# EAGLE design bat (EAGLE 9.5.1)
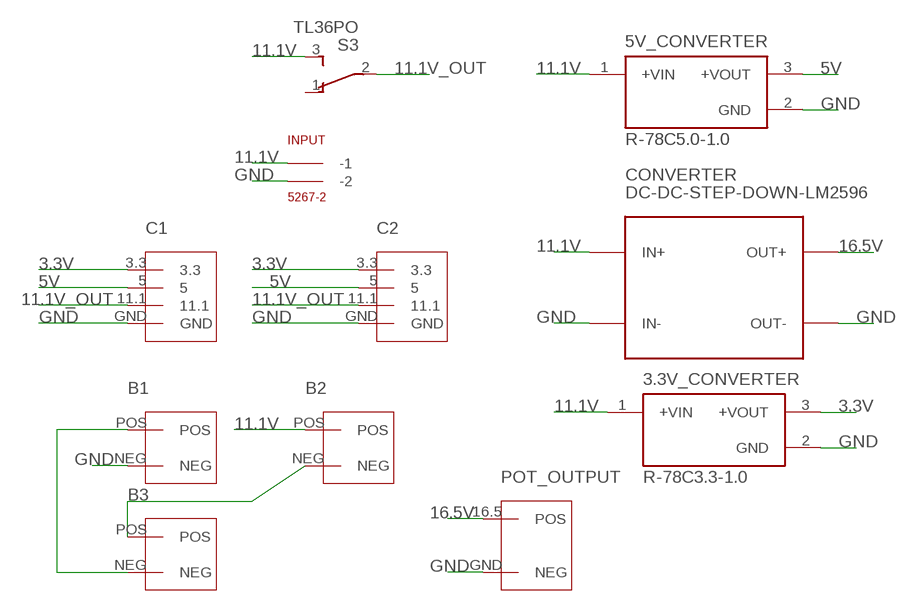
[diagram p0: schematic, sheet 1]

## Parts
3.3V_CONVERTER  R-78C3.3-1.0  R-78C5.0-1.0  [CONV_R-78C5.0-1.0]
5V_CONVERTER  R-78C5.0-1.0  [CONV_R-78C5.0-1.0]
B1  2_PIN_WIRE  [2_PIN_WIRE]
B2  2_PIN_WIRE  [2_PIN_WIRE]
B3  2_PIN_WIRE  [2_PIN_WIRE]
C1  4_PIN_WIRE  [4_PIN_WIRE]
C2  4_PIN_WIRE  [4_PIN_WIRE]
CONVERTER  DC-DC-STEP-DOWN-LM2596  [DC-DC-STEP-DOWN-LM2596]
INPUT  5267-2  [5267-2]
POT_OUTPUT  2_PIN_SMALL  [2_PIN_SMALL]
S3  TL36PO  [TL3XPO]

## Nets
3.3V: 3.3V_CONVERTER.3(+VOUT) C1.3.3 C2.3.3
5V: 5V_CONVERTER.3(+VOUT) C1.5 C2.5
11.1V: 3.3V_CONVERTER.1(+VIN) 5V_CONVERTER.1(+VIN) B2.POS CONVERTER.IN+ INPUT.P$1(-1) S3.3(S)
11.1V_OUT: C1.11.1 C2.11.1 S3.2(P)
16.5V: CONVERTER.OUT+ POT_OUTPUT.16.5(POS)
GND: 3.3V_CONVERTER.2(GND) 5V_CONVERTER.2(GND) B1.NEG C1.GND C2.GND CONVERTER.IN- CONVERTER.OUT- INPUT.P$2(-2) POT_OUTPUT.GND(NEG)
N$1: B1.POS B3.NEG
N$2: B2.NEG B3.POS
Unconnected: S3.1(O)

## Library data of the parts
3.3V_CONVERTER 5V_CONVERTER = R-78C5.0-1.0:R-78C5.0-1.0: 1.0 Amp SIP3 Single Output; AVAILABILITY: Unavailable; DESCRIPTION: 1A DC/DC-Converter 'INNOLINE' SIP3 reg; MF: Recom Power; MP: R-78C5.0-1.0; PACKAGE: SIP-3 Recom Power; PRICE: None
B1-B3 = R-78C5.0-1.0:2_PIN_WIRE
C1 C2 = R-78C5.0-1.0:4_PIN_WIRE
CONVERTER = diy-modules:DC-DC-STEP-DOWN-LM2596: DC/DC Step-Down Regulator based on LM2596-ADJ chip LM2596 datasheet available here: http://www.ti.com/lit/ds/symlink/lm2596.pdf Click here to find device on ebay.com <http://www.ebay.com/sch/lm2596+power+regulator>
INPUT = con-molex-spox:5267-2
POT_OUTPUT = R-78C5.0-1.0:2_PIN_SMALL
S3 = switch:TL36PO: TINY SWITCH ON - ON Source: http://www2.produktinfo.conrad.com/datenblaetter/700000-724999/705152-da-01-de-Subminiaturschalter_TL_36YO.pdf

## Board
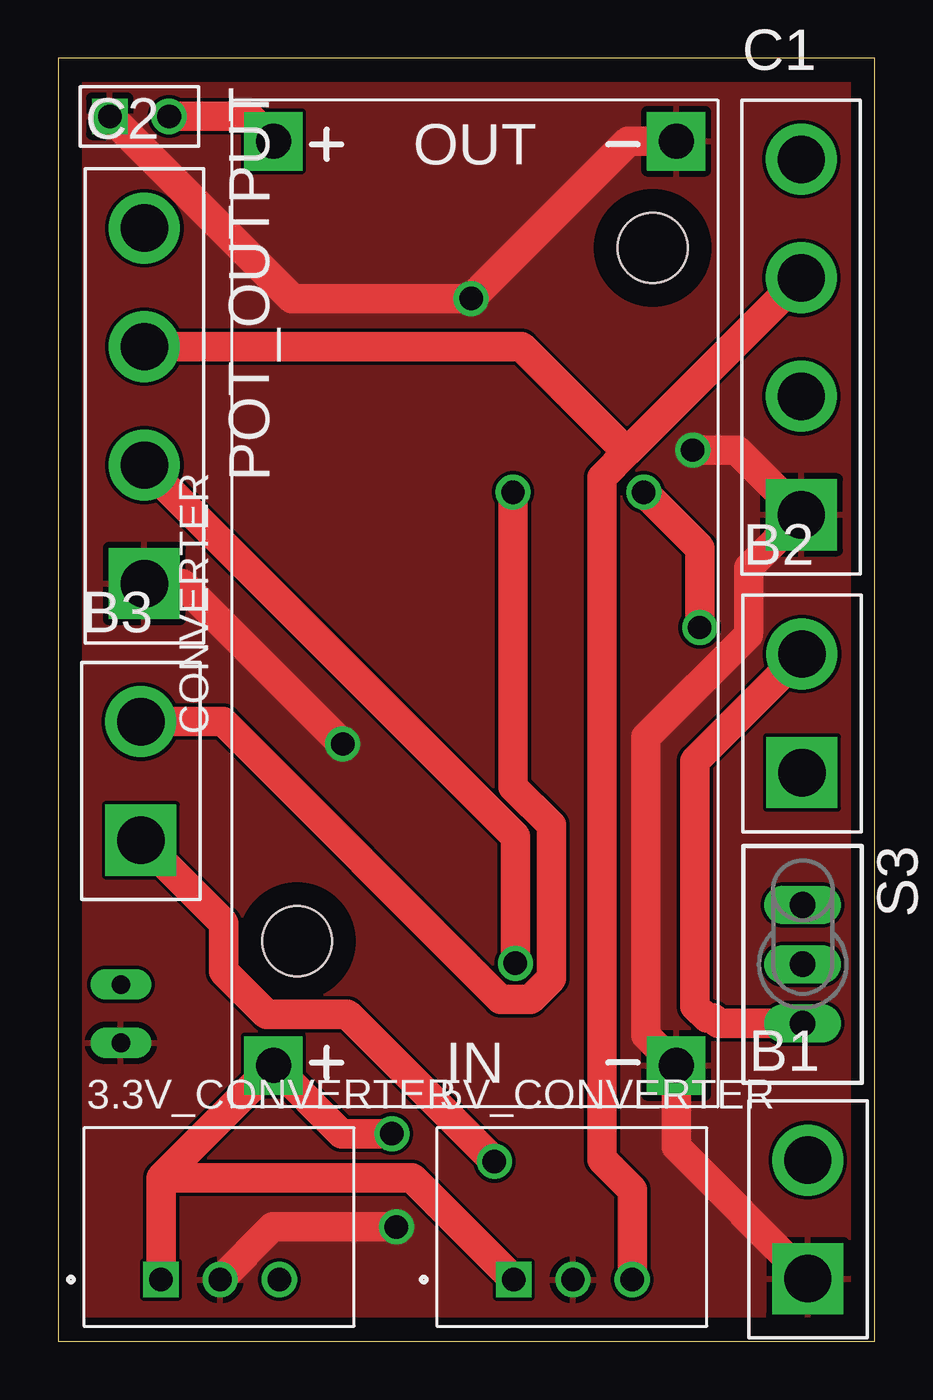
[diagram p1: board, top side]
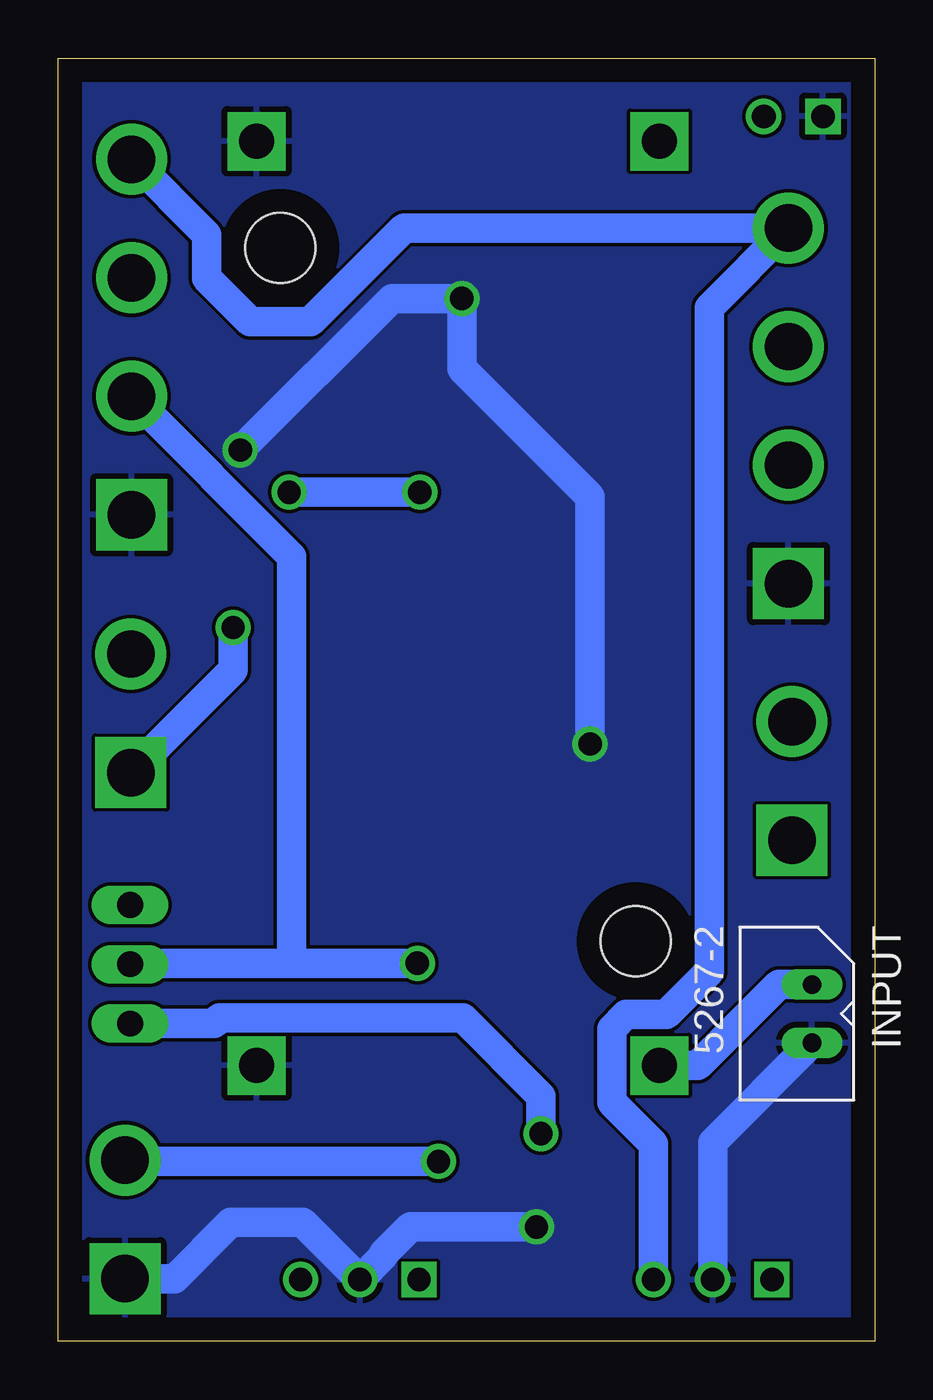
[diagram p2: board, bottom side, seen from below]

Size 35 x 55 mm. Coordinates in mm from the lower left corner, seen from the top.
Outline: 0,0 35,0 35,55 0,55 0,0
Copper layers (1*16): Top 0.035mm / dielectric 1.5mm / Bottom 0.035mm
Design rules "default": minimum track width 6mil, minimum drill 0.35mm, track to track 6mil, track to pad 6mil, pad to pad 6mil, via to via 6mil, smd to smd 6mil, copper to edge 40mil, drill to drill 6mil, minimum pad ring 10mil, minimum via ring 8mil, stop-mask expansion 4mil, vias tented up to drill 0mil, thermal gap 10mil

### Footprints (pad centres in the part's own frame; a part is rotated, then mirrored left to right if it is on the bottom)
CONV_R-78C5.0-1.0 = drill 1 square: 1 -2.54,-2.25 | drill 1: 2 0,-2.25; 3 2.54,-2.25
2_PIN_WIRE = drill 2.032 square: NEG 0,-1.27 | drill 2.032: POS 0,3.81
4_PIN_WIRE = drill 2.032: 3.3 0,7.62; 5 0,2.54; 11.1 0,-2.54 | drill 2.032 square: GND 0,-7.62
DC-DC-STEP-DOWN-LM2596 = drill 1.5 pad 2.5 square: IN+ -19.812,8.636; IN- -19.812,-8.636; OUT+ 19.812,8.636; OUT- 19.812,-8.636 | hole 3: -14.478,7.62; 15.24,-7.62
5267-2 = drill 0.8 long: P$1 0,0; P$2 2.5,0
2_PIN_SMALL = drill 1.016: 16.5 0,1.27 | drill 1.016 square: GND 0,-1.27
TL3XPO = drill 1.1 pad 1.422 long: 1 -2.54,0; 2 0,0; 3 2.54,0

### Placement (x,y rotation side)
3.3V_CONVERTER  6.94,4.89 0 top
5V_CONVERTER  22.07,4.89 0 top
B1  32.14,3.95 0 top
B2  31.89,25.65 0 top
B3  3.54,22.75 0 top
C1  31.86,43.05 0 top
C2  3.69,40.1 0 top
CONVERTER  17.86,31.63 90 top
INPUT  2.68,15.29 270 bottom
POT_OUTPUT  3.48,52.51 270 top
S3  31.92,16.16 270 top

### Tracks (layer width: path | path; a pad name or v marks a point on that pad's centre or on a via)
3.3V
  Bottom 1.27: 3.3V_CONVERTER.3 9.48,8.46 11.26,10.24 11.26,13.39 10.65,14 8.94,14 7.09,15.85 7.09,44.32 C2.3.3 20.17,47.72 24.18,43.72 26.79,43.72 28.63,45.56 28.63,47.44 C1.3.3
5V
  Top 1.27: 5V_CONVERTER.3 24.61,6.49 23.3,7.8 23.3,37.03 24.39,38.12 | 24.39,38.12 C1.5 | C2.5 19.86,42.64 24.39,38.12
11.1V  (via drill 1)
  Top 1.27: 3.3V_CONVERTER.1 4.4,6.99 | 4.4,6.99 CONVERTER.IN+ 12.14,8.9 v14.3,8.9 | 5V_CONVERTER.1 15.18,6.99 4.4,6.99 | B2.POS 27.3,24.87 27.3,14.36 27.8,13.86 28.07,13.86 28.31,13.62 S3.3
  Bottom 1.27: INPUT.P$1 4.11,15.29 7.58,11.82 CONVERTER.IN+ | S3.3 28.31,13.62 28.07,13.86 17.66,13.86 14.3,10.5 v14.3,8.9 14.3,8.8
11.1V_OUT  (via drill 1)
  Top 1.27: C2.11.1 19.6,21.65 19.6,17.3 v19.6,16.2 19.6,16.1
  Bottom 1.27: v19.6,16.2 25,16.2 | 25,16.2 31.88,16.2 S3.2 | C1.11.1 25,33.65 25,16.2
16.5V
  Top 1.27: POT_OUTPUT.16.5 8.16,52.51 CONVERTER.OUT+
GND  (via drill 1)
  Top 1.27: B1.NEG 26.5,8.32 CONVERTER.IN- 25.2,13.11 25.2,25.9 29.58,30.28 29.58,30.42 29.6,30.44 29.6,33.17 C1.GND 29.09,38.2 v27.2,38.2 | v14.5,4.9 9.2,4.9 3.3V_CONVERTER.2 | CONVERTER.OUT- 24.44,51.44 v17.7,44.7 10.02,44.7 POT_OUTPUT.GND | v12.2,25.6 5.32,32.48 C2.GND
  Bottom 1.27: B1.NEG 30.02,2.68 27.6,5.1 24.53,5.1 5V_CONVERTER.2 21.07,3.64 21.07,3.72 19.89,4.9 v14.5,4.9 14.4,4.9 | 3.3V_CONVERTER.2 6.94,8.53 INPUT.P$2 | v27.2,38.2 20.7,44.7 v17.7,44.7 17.7,41.7 12.2,36.2 v12.2,25.6
  pour Top: -4.6,57.2 -4.6,-3.1 42.5,-3.1 42.5,57.2
  pour Bottom: -8.5,60.3 -8.5,-5.9 51.1,-5.9 51.1,60.3
N$1  (via drill 1)
  Top 1.27: v18.7,7.7 12.4,14 8.94,14 7.09,15.85 7.09,17.93 B3.NEG
  Bottom 1.27: v18.7,7.7 32.08,7.7 B1.POS
N$2  (via drill 1)
  Top 1.27: B3.POS 7.07,26.56 18.96,14.66 20.24,14.66 21.14,15.56 21.14,22.12 19.5,23.76 v19.5,36.4 19.5,36.5 | v25.1,36.4 27.5,34 v27.5,30.6
  Bottom 1.27: v19.5,36.4 v25.1,36.4 | B2.NEG 27.5,28.77 v27.5,30.6